# EAGLE schematic Alarmsystem (EAGLE 9.6.2)
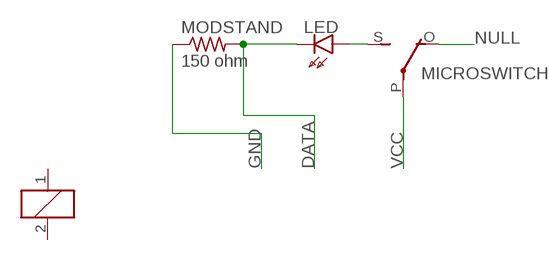
[diagram p0: schematic, sheet 1]

## Parts
LED  HLMP6  [HLMP6]
MICROSWITCH  E3206S  [E3206S]
MODSTAND  150 ohm  R-US_0204/7  [0204/7]

## Nets
DATA: LED.K MODSTAND.2
GND: MODSTAND.1
N$1: LED.A MICROSWITCH.S(2:S)
NULL: MICROSWITCH.O(2:O)
VCC: MICROSWITCH.P(2:P)
Unconnected: MICROSWITCH.1 MICROSWITCH.2

## Library data of the parts
LED = display-hp:HLMP6: LED 2mm horizontal; MF: AGILENT TECHNOLOGIES; MPN: HLMP-6500; OC_FARNELL: 1652490; OC_NEWARK: 40K0088
MICROSWITCH = relay:E3206S: RELAY 1 x switch, Eichhoff/distributor Schukat; OC_FARNELL: unknown; OC_NEWARK: unknown
MODSTAND = rcl:R-US_: RESISTOR, American symbol; SPICEPREFIX: R